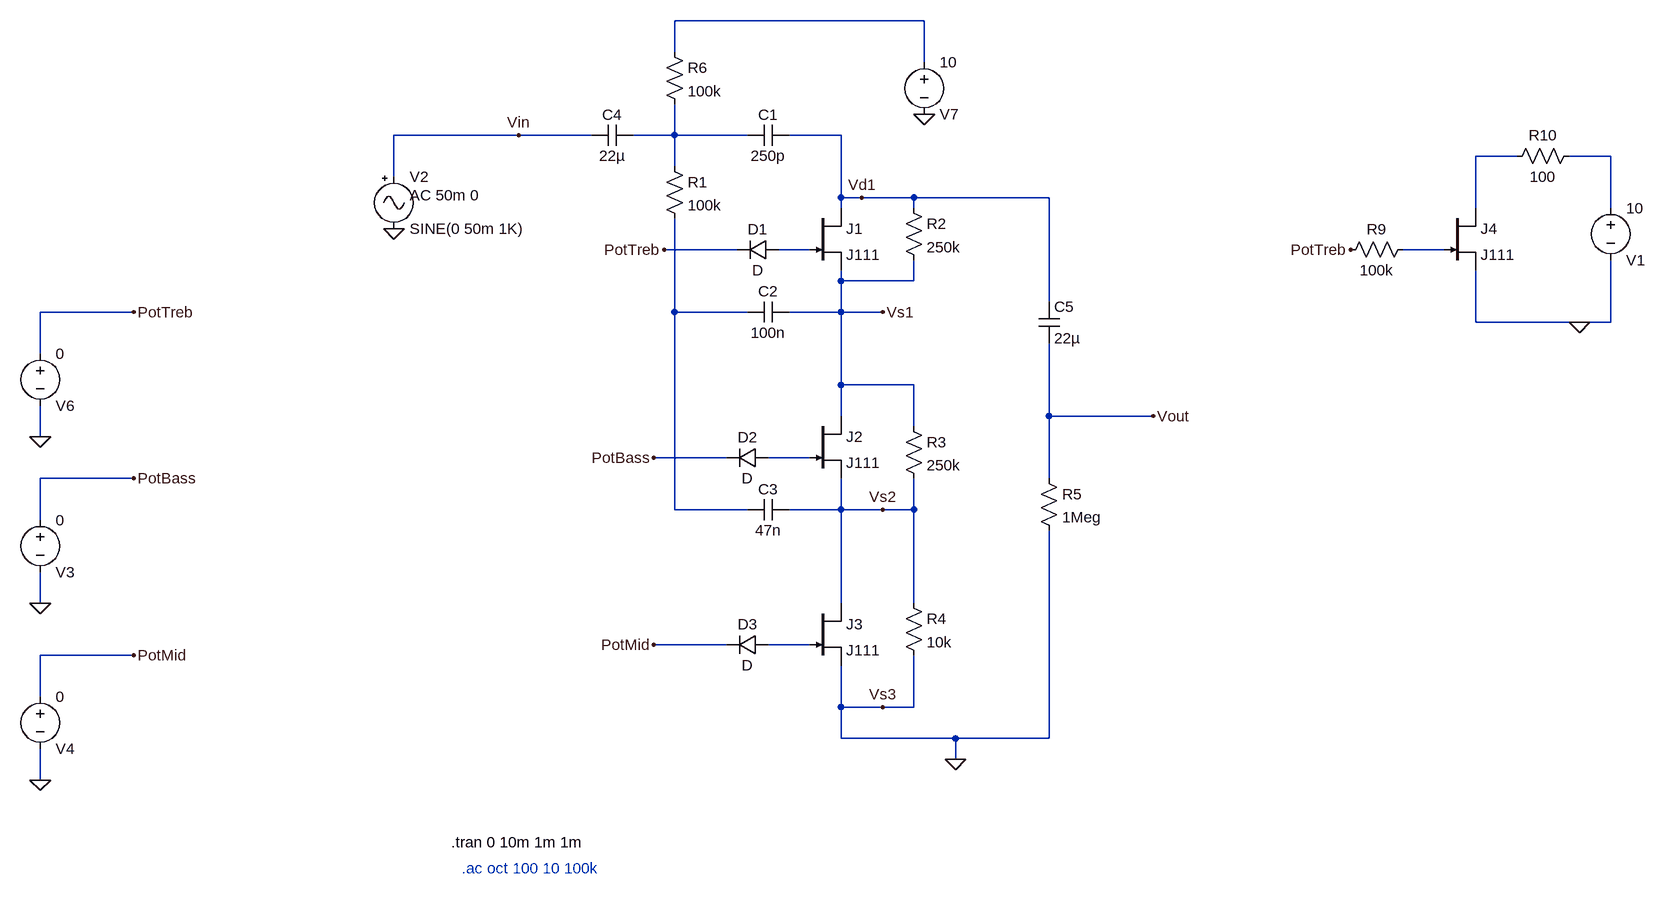
[diagram p0: schematic Draft1.asc]
Draft1.asc, the LTspice schematic file:
Version 4
SHEET 1 1576 1000
WIRE 464 -320 80 -320
WIRE 80 -272 80 -320
WIRE 464 -256 464 -320
WIRE -160 -144 -352 -144
WIRE -48 -144 -160 -144
WIRE 80 -144 80 -192
WIRE 80 -144 16 -144
WIRE 192 -144 80 -144
WIRE 336 -144 256 -144
WIRE 1376 -112 1312 -112
WIRE 1520 -112 1456 -112
WIRE 80 -96 80 -144
WIRE -352 -80 -352 -144
WIRE 336 -48 336 -144
WIRE 368 -48 336 -48
WIRE 448 -48 368 -48
WIRE 656 -48 448 -48
WIRE 336 -32 336 -48
WIRE 448 -32 448 -48
WIRE 1312 -32 1312 -112
WIRE 1520 -32 1520 -112
WIRE 176 32 64 32
WIRE 288 32 240 32
WIRE 1264 32 1200 32
WIRE 336 80 336 64
WIRE 448 80 448 48
WIRE 448 80 336 80
WIRE 656 112 656 -48
WIRE -752 128 -896 128
WIRE 80 128 80 -16
WIRE 192 128 80 128
WIRE 336 128 336 80
WIRE 336 128 256 128
WIRE 400 128 336 128
WIRE 1312 144 1312 64
WIRE 1472 144 1312 144
WIRE 1520 144 1520 48
WIRE 1520 144 1472 144
WIRE -896 192 -896 128
WIRE 336 240 336 128
WIRE 448 240 336 240
WIRE 336 288 336 240
WIRE 656 288 656 176
WIRE 816 288 656 288
WIRE 448 304 448 240
WIRE -896 320 -896 272
WIRE 160 352 48 352
WIRE 288 352 224 352
WIRE -752 384 -896 384
WIRE 656 384 656 288
WIRE 80 432 80 128
WIRE 192 432 80 432
WIRE 336 432 336 384
WIRE 336 432 256 432
WIRE 400 432 336 432
WIRE 448 432 448 384
WIRE 448 432 400 432
WIRE -896 448 -896 384
WIRE -896 576 -896 528
WIRE 336 576 336 432
WIRE 448 576 448 432
WIRE 160 640 48 640
WIRE 288 640 224 640
WIRE -752 656 -896 656
WIRE -896 720 -896 656
WIRE 336 736 336 672
WIRE 400 736 336 736
WIRE 448 736 448 656
WIRE 448 736 400 736
WIRE 336 784 336 736
WIRE 512 784 336 784
WIRE 656 784 656 464
WIRE 656 784 512 784
WIRE 512 816 512 784
WIRE -896 848 -896 800
FLAG 512 816 0
FLAG -352 0 0
FLAG 64 32 PotTreb
FLAG 48 352 PotBass
FLAG 48 640 PotMid
FLAG -896 320 0
FLAG -752 128 PotTreb
FLAG -896 576 0
FLAG -896 848 0
FLAG -752 384 PotBass
FLAG -752 656 PotMid
FLAG 816 288 Vout
FLAG -160 -144 Vin
FLAG 1120 32 PotTreb
FLAG 1472 144 0
FLAG 464 -176 0
FLAG 400 128 Vs1
FLAG 400 432 Vs2
FLAG 400 736 Vs3
FLAG 368 -48 Vd1
SYMBOL njf 288 -32 R0
SYMATTR InstName J1
SYMATTR Value J111
SYMBOL cap 256 -160 R90
WINDOW 0 0 32 VBottom 2
WINDOW 3 32 32 VTop 2
SYMATTR InstName C1
SYMATTR Value 250p
SYMBOL res 64 -112 R0
SYMATTR InstName R1
SYMATTR Value 100k
SYMBOL cap 256 112 R90
WINDOW 0 0 32 VBottom 2
WINDOW 3 32 32 VTop 2
SYMATTR InstName C2
SYMATTR Value 100n
SYMBOL res 432 -48 R0
SYMATTR InstName R2
SYMATTR Value 250k
SYMBOL njf 288 288 R0
SYMATTR InstName J2
SYMATTR Value J111
SYMBOL njf 288 576 R0
SYMATTR InstName J3
SYMATTR Value J111
SYMBOL cap 256 416 R90
WINDOW 0 0 32 VBottom 2
WINDOW 3 32 32 VTop 2
SYMATTR InstName C3
SYMATTR Value 47n
SYMBOL res 640 368 R0
SYMATTR InstName R5
SYMATTR Value 1Meg
SYMBOL cap 16 -160 R90
WINDOW 0 0 32 VBottom 2
WINDOW 3 32 32 VTop 2
SYMATTR InstName C4
SYMATTR Value 22µ
SYMBOL Misc\\signal -352 -96 R0
WINDOW 123 24 44 Left 2
WINDOW 39 0 0 Left 0
SYMATTR InstName V2
SYMATTR Value SINE(0 50m 1K)
SYMATTR Value2 AC 50m 0
SYMBOL voltage 1520 -48 R0
WINDOW 0 24 96 Left 2
WINDOW 3 24 16 Left 2
WINDOW 123 0 0 Left 0
WINDOW 39 0 0 Left 0
SYMATTR InstName V1
SYMATTR Value 10
SYMBOL voltage -896 432 R0
WINDOW 0 24 96 Left 2
WINDOW 3 24 16 Left 2
WINDOW 123 0 0 Left 0
WINDOW 39 0 0 Left 0
SYMATTR InstName V3
SYMATTR Value 0
SYMBOL voltage -896 704 R0
WINDOW 0 24 96 Left 2
WINDOW 3 24 16 Left 2
WINDOW 123 0 0 Left 0
WINDOW 39 0 0 Left 0
SYMATTR InstName V4
SYMATTR Value 0
SYMBOL njf 1264 -32 R0
SYMATTR InstName J4
SYMATTR Value J111
SYMBOL res 1216 16 R90
WINDOW 0 0 56 VBottom 2
WINDOW 3 32 56 VTop 2
SYMATTR InstName R9
SYMATTR Value 100k
SYMBOL res 1472 -128 R90
WINDOW 0 0 56 VBottom 2
WINDOW 3 32 56 VTop 2
SYMATTR InstName R10
SYMATTR Value 100
SYMBOL voltage -896 176 R0
WINDOW 0 24 96 Left 2
WINDOW 3 24 16 Left 2
WINDOW 123 0 0 Left 0
WINDOW 39 0 0 Left 0
SYMATTR InstName V6
SYMATTR Value 0
SYMBOL res 432 288 R0
SYMATTR InstName R3
SYMATTR Value 250k
SYMBOL res 432 560 R0
SYMATTR InstName R4
SYMATTR Value 10k
SYMBOL voltage 464 -272 R0
WINDOW 0 24 96 Left 2
WINDOW 3 24 16 Left 2
WINDOW 123 0 0 Left 0
WINDOW 39 0 0 Left 0
SYMATTR InstName V7
SYMATTR Value 10
SYMBOL cap 640 112 R0
SYMATTR InstName C5
SYMATTR Value 22µ
SYMBOL res 64 -288 R0
SYMATTR InstName R6
SYMATTR Value 100k
SYMBOL diode 240 16 R90
WINDOW 0 0 32 VBottom 2
WINDOW 3 32 32 VTop 2
SYMATTR InstName D1
SYMBOL diode 224 336 R90
WINDOW 0 0 32 VBottom 2
WINDOW 3 32 32 VTop 2
SYMATTR InstName D2
SYMBOL diode 224 624 R90
WINDOW 0 0 32 VBottom 2
WINDOW 3 32 32 VTop 2
SYMATTR InstName D3
TEXT -264 944 Left 2 !.tran 0 10m 1m 1m
TEXT -248 984 Left 2 ;.ac oct 100 10 100k

The netlist it stands for:
* Draft1.asc
J1 Vd1 N005 Vs1 J111
C1 Vd1 N002 250p
R1 N002 N007 100k
C2 Vs1 N007 100n
R2 Vd1 Vs1 250k
J2 Vs1 N008 Vs2 J111
J3 Vs2 N009 0 J111
C3 Vs2 N007 47n
R5 Vout 0 1Meg
C4 N002 Vin 22µ
V2 Vin 0 SINE(0 50m 1K) AC 50m 0
V1 N004 0 10
V3 PotBass 0 0
V4 PotMid 0 0
J4 N003 N006 0 J111
R9 N006 PotTreb 100k
R10 N004 N003 100
V6 PotTreb 0 0
R3 Vs1 Vs2 250k
R4 Vs2 0 10k
V7 N001 0 10
C5 Vd1 Vout 22µ
R6 N001 N002 100k
D1 N005 PotTreb D
D2 N008 PotBass D
D3 N009 PotMid D
.model D D
.lib standard.dio
.model NJF NJF
.model PJF PJF
.lib standard.jft
.tran 0 10m 1m 1m
* .ac oct 100 10 100k
.backanno
.end